# EAGLE schematic collatz_box (EAGLE 6.2)
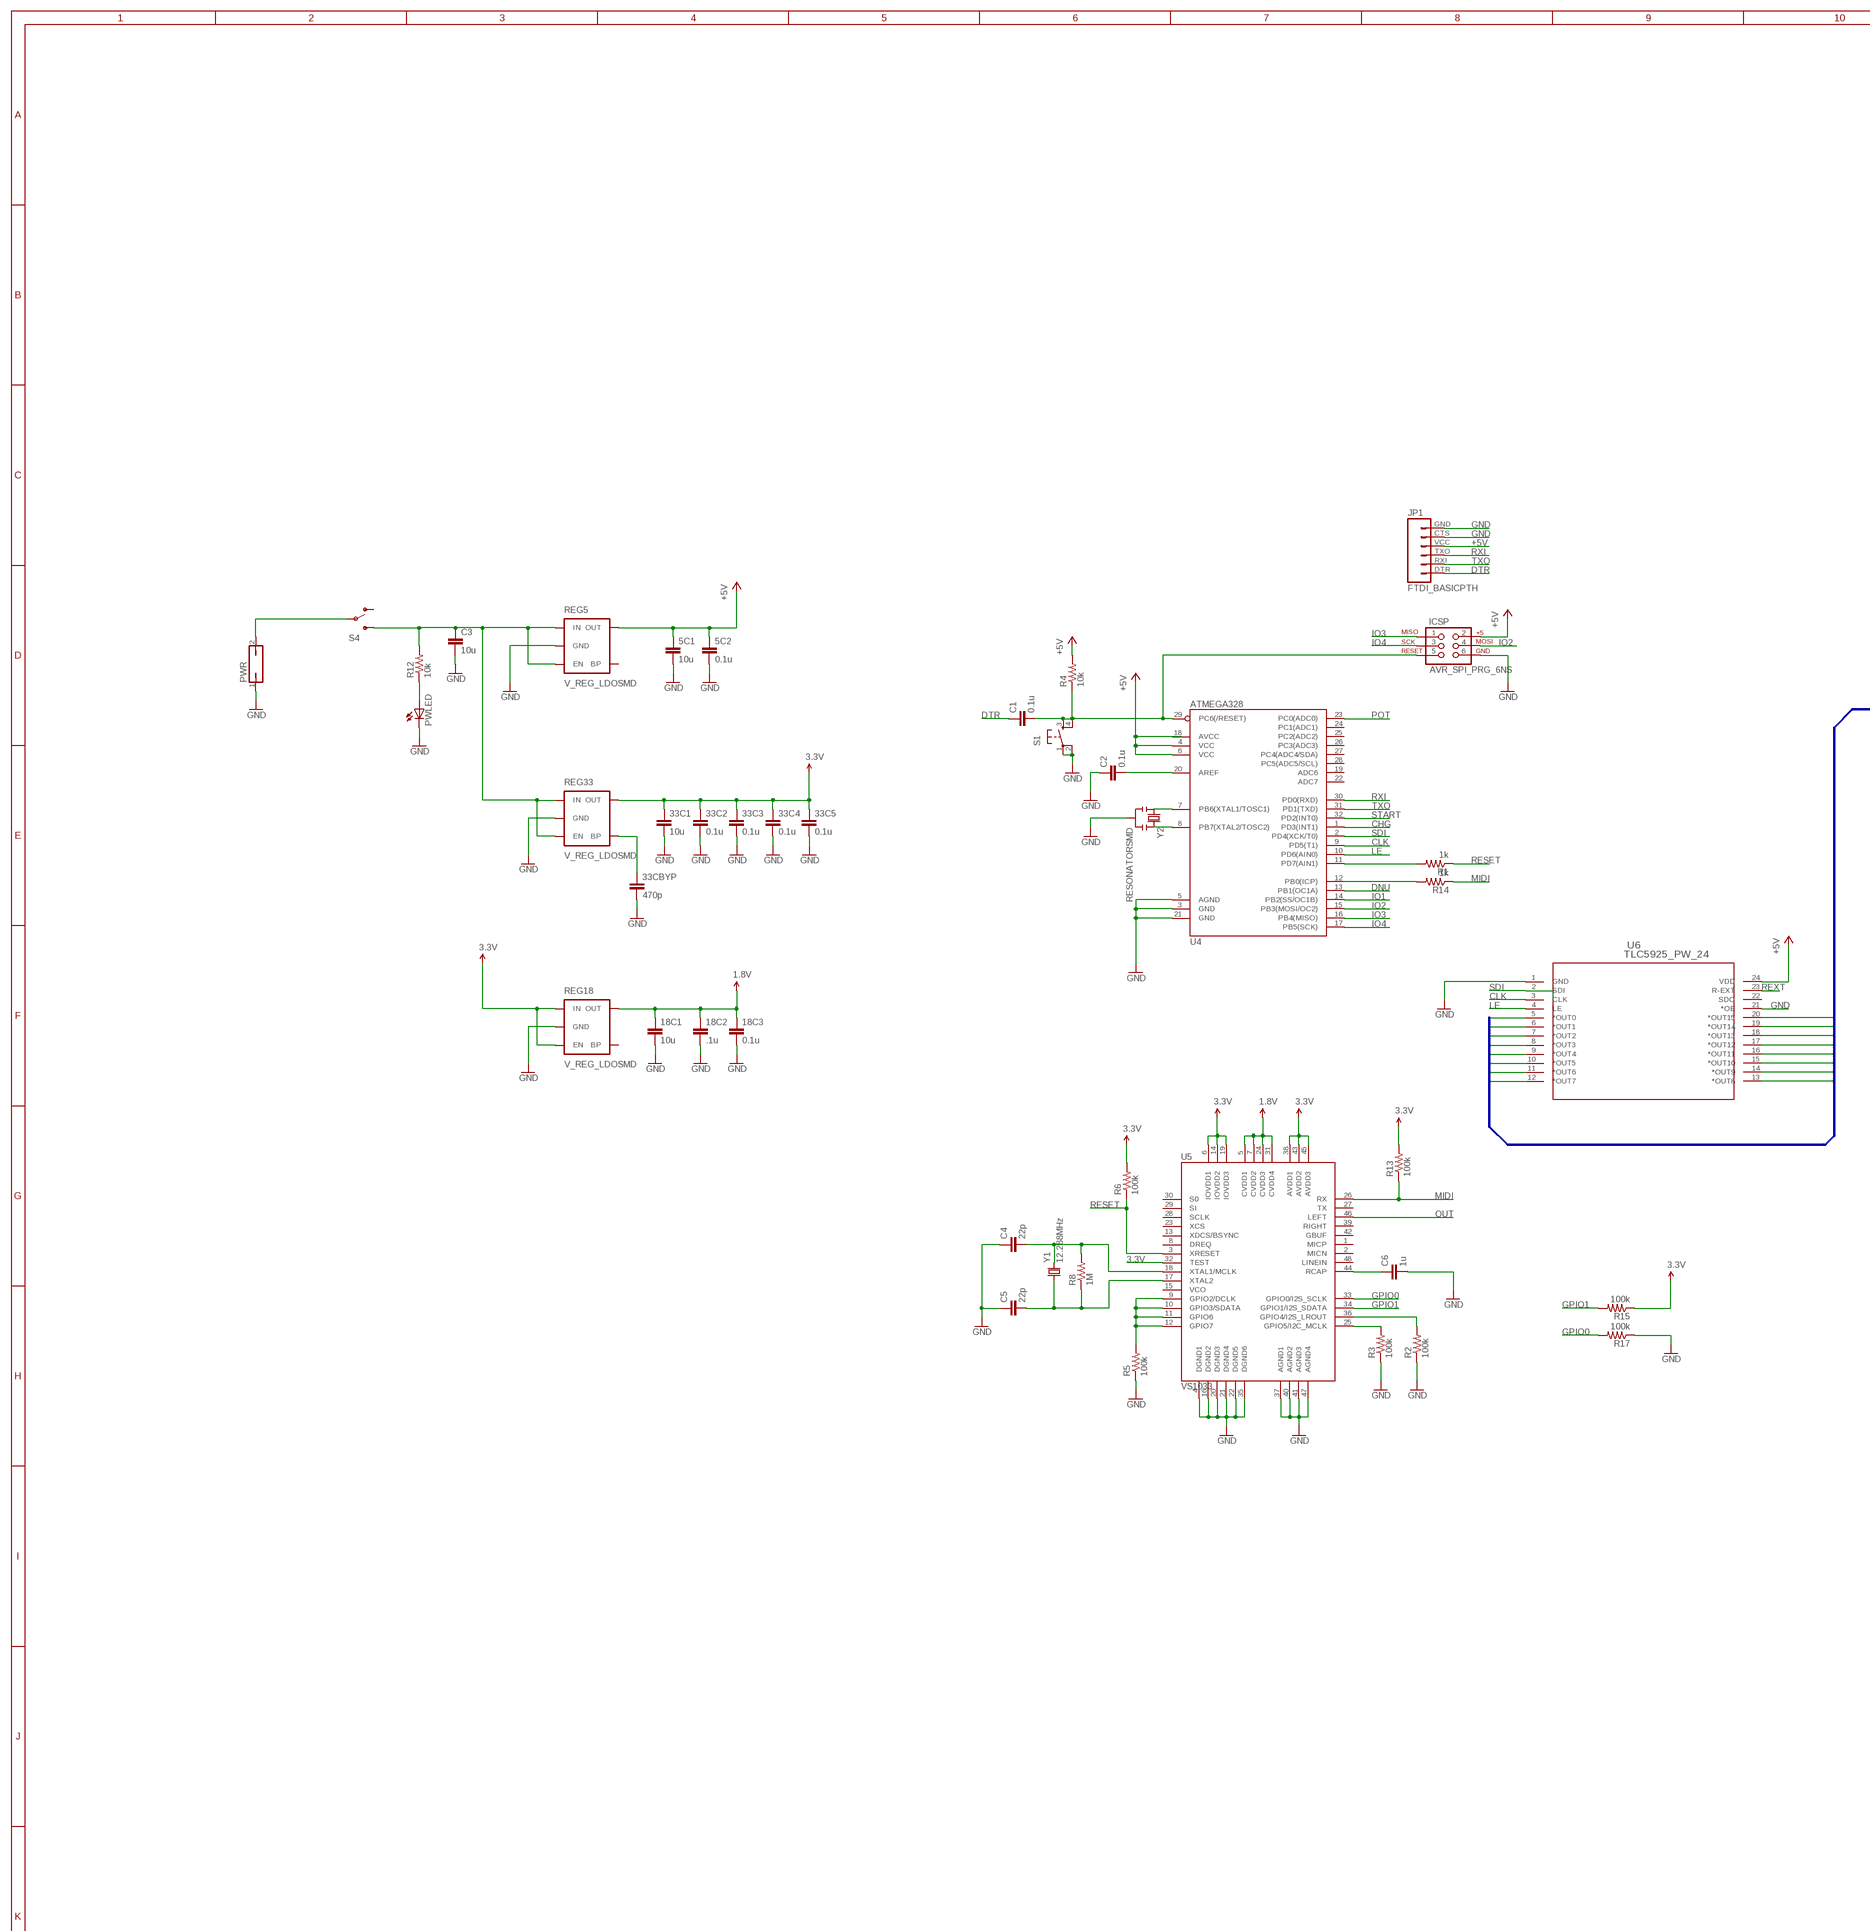
[diagram p0: schematic, sheet 1, part 1 of 3]
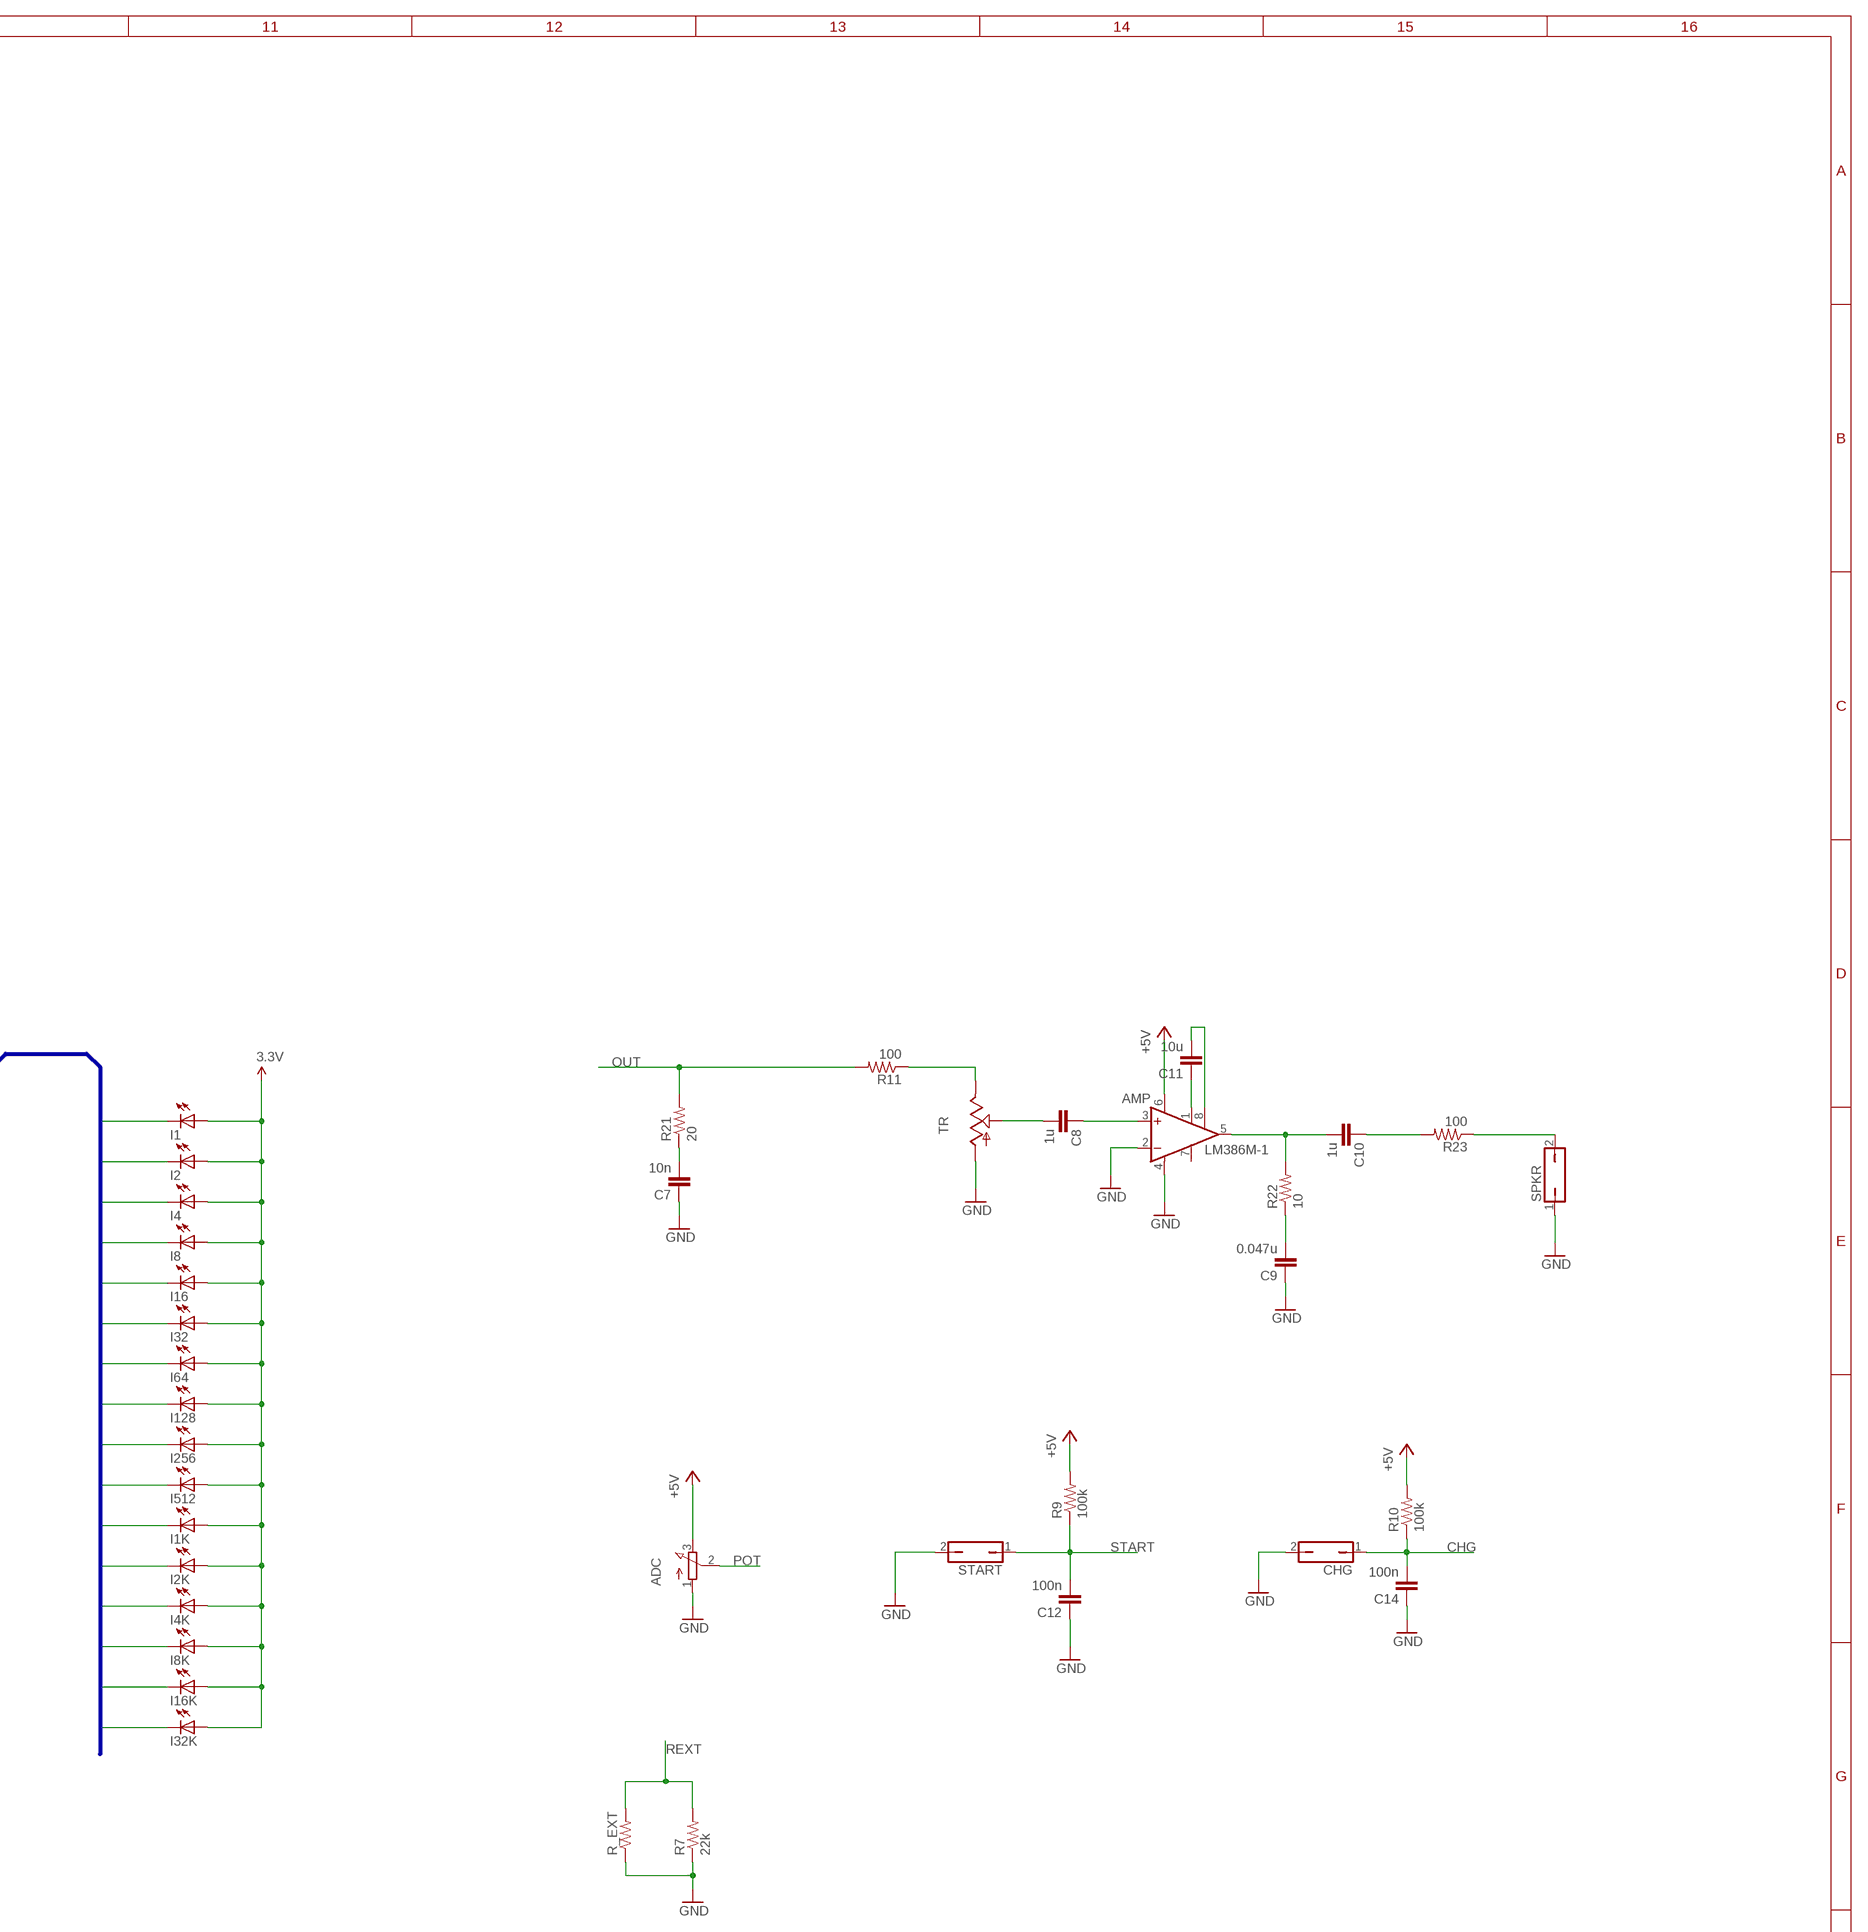
[diagram p1: schematic, sheet 1, part 2 of 3]
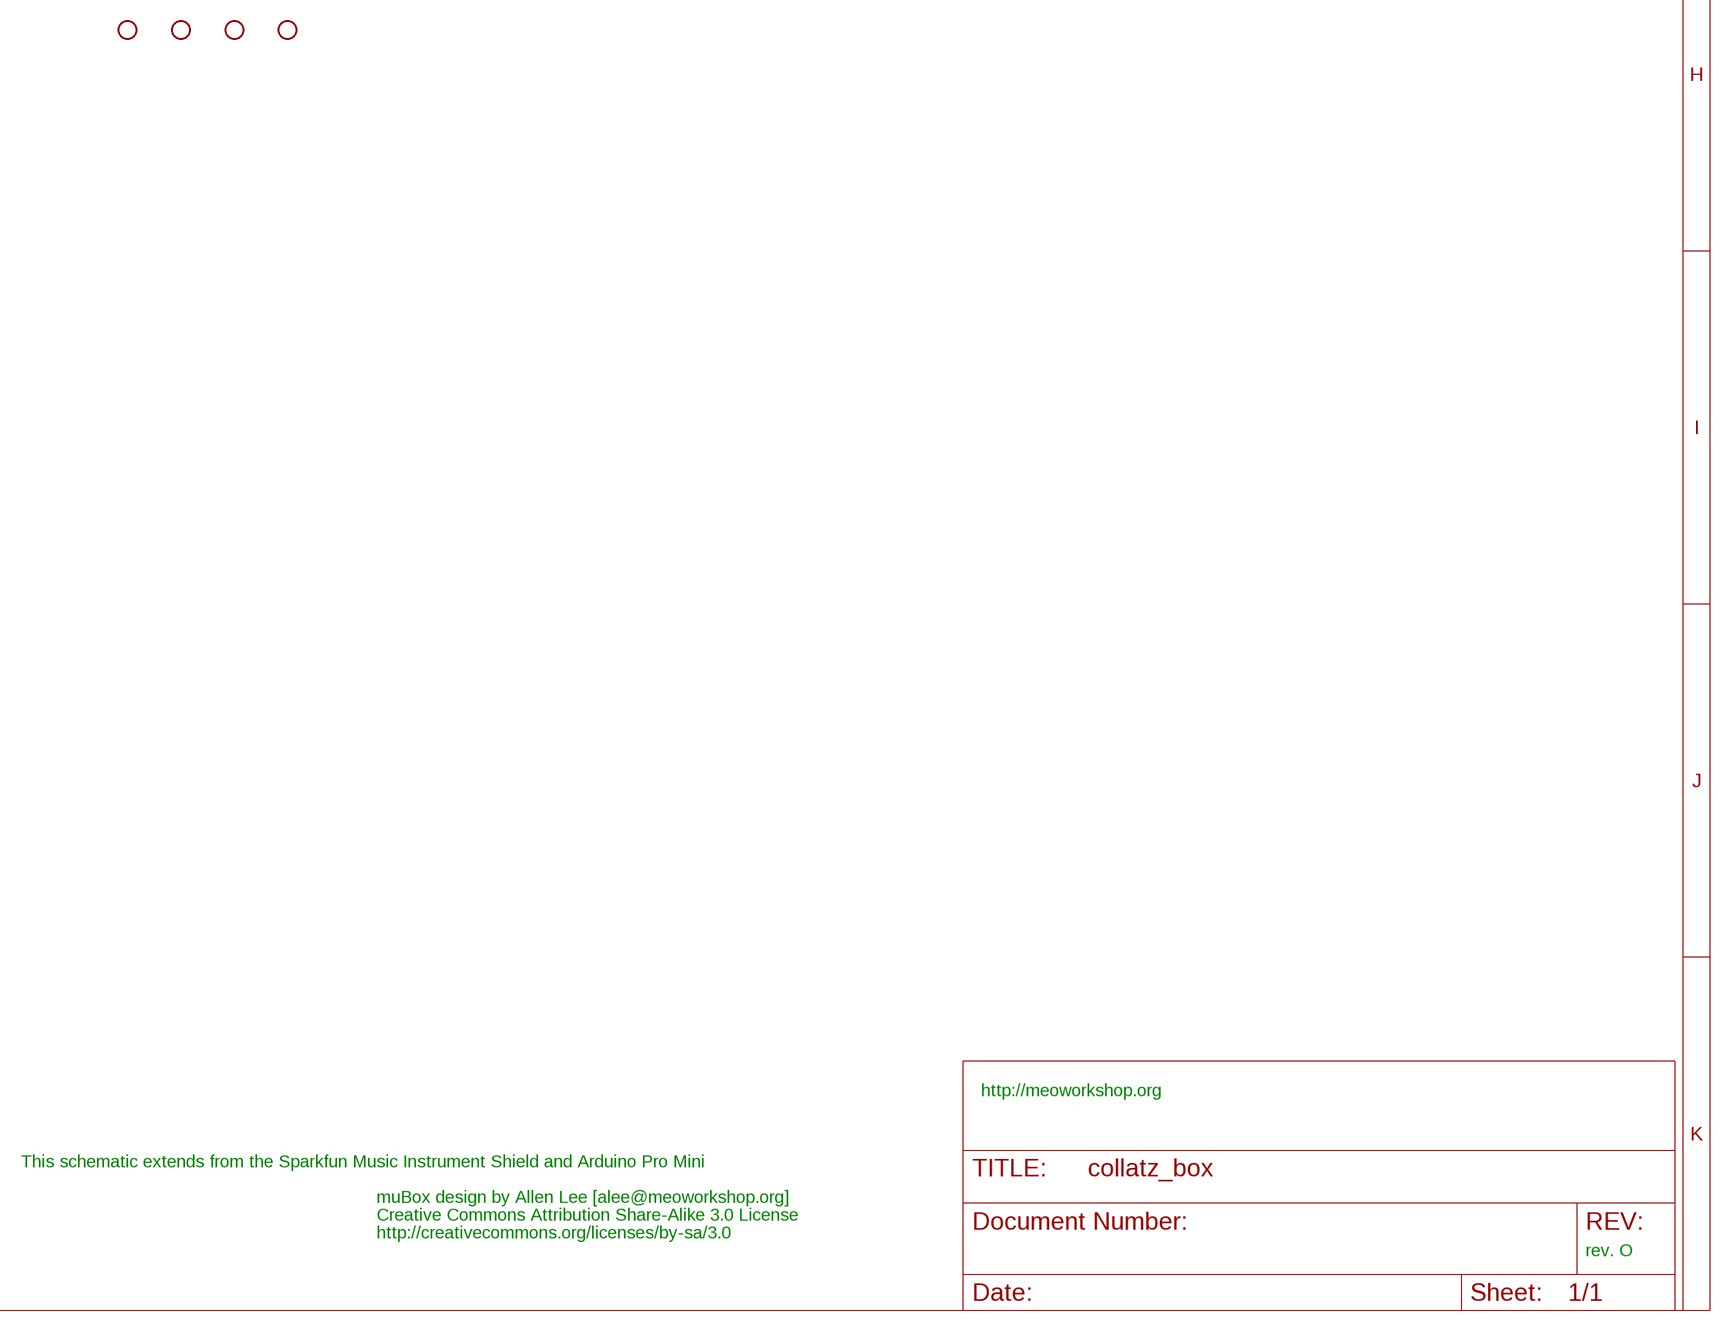
[diagram p2: schematic, sheet 1, part 3 of 3]

## Parts
5C1  10u  CAP1206  [1206]
5C2  0.1u  CAP0805  [0805]
18C1  10u  CAP1206  [1206]
18C2  .1u  CAP0805  [0805]
18C3  0.1u  CAP0805  [0805]
33C1  10u  CAP1206  [1206]
33C2  0.1u  CAP0805  [0805]
33C3  0.1u  CAP0805  [0805]
33C4  0.1u  CAP0805  [0805]
33C5  0.1u  CAP0805  [0805]
33CBYP  470p  CAP0805  [0805]
ADC  3RP/1610N  [3RP/1610N]
AMP  LM386M-1  [SO08]
C1  0.1u  CAP0805  [0805]
C2  0.1u  CAP0805  [0805]
C3  10u  CAP1206  [1206]
C4  22p  CAP0805  [0805]
C5  22p  CAP0805  [0805]
C6  1u  CAP0805  [0805]
C7  10n  CAP0805  [0805]
C8  1u  CAP0805  [0805]
C9  0.047u  CAP0805  [0805]
C10  1u  CAP0805  [0805]
C11  10u  CAP0805  [0805]
C12  100n  CAP0805  [0805]
C14  100n  CAP0805  [0805]
CHG  JP1Q  [JP1]
I1  LEDCHIPLED_1206  [CHIPLED_1206]
I1K  LEDCHIPLED_1206  [CHIPLED_1206]
I2  LEDCHIPLED_1206  [CHIPLED_1206]
I2K  LEDCHIPLED_1206  [CHIPLED_1206]
I4  LEDCHIPLED_1206  [CHIPLED_1206]
I4K  LEDCHIPLED_1206  [CHIPLED_1206]
I8  LEDCHIPLED_1206  [CHIPLED_1206]
I8K  LEDCHIPLED_1206  [CHIPLED_1206]
I16  LEDCHIPLED_1206  [CHIPLED_1206]
I16K  LEDCHIPLED_1206  [CHIPLED_1206]
I32  LEDCHIPLED_1206  [CHIPLED_1206]
I32K  LEDCHIPLED_1206  [CHIPLED_1206]
I64  LEDCHIPLED_1206  [CHIPLED_1206]
I128  LEDCHIPLED_1206  [CHIPLED_1206]
I256  LEDCHIPLED_1206  [CHIPLED_1206]
I512  LEDCHIPLED_1206  [CHIPLED_1206]
ICSP  AVR_SPI_PRG_6NS  [2X3-NS]
JP1  FTDI_BASICPTH  [FTDI_BASIC]
JP2  STAND-OFF  [STAND-OFF]
JP3  STAND-OFF  [STAND-OFF]
JP4  STAND-OFF  [STAND-OFF]
JP5  STAND-OFF  [STAND-OFF]
PWLED  LEDCHIPLED_1206  [CHIPLED_1206]
PWR  JP1Q  [JP1]
R1  1k  RESISTOR0805-RES  [0805]
R2  100k  RESISTOR0805-RES  [0805]
R3  100k  RESISTOR0805-RES  [0805]
R4  10k  RESISTOR0805-RES  [0805]
R5  100k  RESISTOR0805-RES  [0805]
R6  100k  RESISTOR0805-RES  [0805]
R7  22k  RESISTOR0805-RES  [0805]
R8  1M  RESISTOR0805-RES  [0805]
R9  100k  RESISTOR0805-RES  [0805]
R10  100k  RESISTOR0805-RES  [0805]
R11  100  RESISTOR0805-RES  [0805]
R12  10k  RESISTOR0805-RES  [0805]
R13  100k  RESISTOR0805-RES  [0805]
R14  1k  RESISTOR0805-RES  [0805]
R15  100k  RESISTOR0805-RES  [0805]
R17  100k  RESISTOR0805-RES  [0805]
R21  20  RESISTOR0805-RES  [0805]
R22  10  RESISTOR0805-RES  [0805]
R23  100  RESISTOR0805-RES  [0805]
R_EXT  RESISTORPTH-1/4W  [AXIAL-0.4]
REG5  V_REG_LDOSMD  [SOT23-5]
REG18  V_REG_LDOSMD  [SOT23-5]
REG33  V_REG_LDOSMD  [SOT23-5]
S1  TAC_SWITCHSMD  [TACTILE_SWITCH_SMD]
S4  SWITCH-SPDTPTH  [SWITCH-SPDT]
SPKR  JP1Q  [JP1]
START  JP1Q  [JP1]
TR  TRIM_US-3223W  [3223W]
U4  ATMEGA328  ATMEGA168  [TQFP32-08]
U5  VS1033  [LQFP-48]
U6  TLC5925_PW_24  [PW24]
Y1  12.288MHz  CRYSTAL5X3  [CRYSTAL-SMD-5X3]
Y2  RESONATORSMD  [RESONATOR-SMD]

## Nets
1.8V: 18C1.1 18C2.1 18C3.1 REG18.5(OUT) U5.5(CVDD1) U5.7(CVDD2) U5.24(CVDD3) U5.31(CVDD4)
3.3V: 33C1.1 33C2.1 33C3.1 33C4.1 33C5.1 I1.A I1K.A I2.A I2K.A I4.A I4K.A I8.A I8K.A I16.A I16K.A I32.A I32K.A I64.A I128.A I256.A I512.A R6.2 R13.2 R15.1 REG18.1(IN) REG18.3(EN) REG33.5(OUT) U5.6(IOVDD1) U5.14(IOVDD2) U5.19(IOVDD3) U5.32(TEST) U5.38(AVDD1) U5.43(AVDD2) U5.45(AVDD3)
+5V: 5C1.1 5C2.1 ADC.3(E) AMP.6(VS) ICSP.2 JP1.VCC R4.2 R9.2 R10.2 REG5.5(OUT) U4.4(VCC) U4.6(VCC) U6.24(VDD)
CHG: C14.2 CHG.1 R10.1 U4.1(PD3(INT1))
CLK: U4.9(PD5(T1)) U6.3(CLK)
DNU: U4.13(PB1(OC1A))
DTR: C1.1 C1.2 ICSP.5 JP1.DTR R4.1 S1.3 S1.4 U4.29(PC6(/RESET))
GND: 5C1.2 5C2.2 18C1.2 18C2.2 18C3.2 33C1.2 33C2.2 33C3.2 33C4.2 33C5.2 33CBYP.2 ADC.1(A) AMP.2(-IN) AMP.4(GND) C2.1 C3.2 C4.1 C5.1 C6.2 C7.1 C9.1 C12.1 C14.1 CHG.2 ICSP.6 JP1.CTS JP1.GND PWLED.C PWR.1 R2.1 R3.1 R5.1 R7.1 R17.1 R_EXT.P$1 REG5.2(GND) REG18.2(GND) REG33.2(GND) S1.1 S1.2 SPKR.1 START.2 TR.1(A) U4.3(GND) U4.5(AGND) U4.21(GND) U5.4(DGND1) U5.16(DGND2) U5.20(DGND3) U5.21(DGND4) U5.22(DGND5) U5.35(DGND6) U5.37(AGND1) U5.40(AGND2) U5.41(AGND3) U5.47(AGND4) U6.1(GND) U6.21(*OE) Y2.2
GPIO0: R17.2 U5.33(GPIO0/I2S_SCLK)
GPIO1: R15.2 U5.34(GPIO1/I2S_SDATA)
IO1: U4.14(PB2(SS/OC1B))
IO2: ICSP.4 U4.15(PB3(MOSI/OC2))
IO3: ICSP.1 U4.16(PB4(MISO))
IO4: ICSP.3 U4.17(PB5(SCK))
LE: U4.10(PD6(AIN0)) U6.4(LE)
MIDI: R13.1 R14.1 U5.26(RX)
N$1: PWLED.A R12.1
N$2: 33CBYP.1 REG33.4(BP)
N$4: C4.2 R8.2 U5.18(XTAL1/MCLK) Y1.3
N$5: C5.2 R8.1 U5.17(XTAL2) Y1.1
N$6: U4.7(PB6(XTAL1/TOSC1)) Y2.1
N$7: R3.2 U5.25(GPIO5/I2C_MCLK)
N$8: R2.2 U5.36(GPIO4/I2S_LROUT)
N$9: U4.8(PB7(XTAL2/TOSC2)) Y2.3
N$10: C6.1 U5.44(RCAP)
N$11: C2.2 U4.20(AREF)
N$12: C10.1 R23.2
N$13: C7.2 R21.1
N$15: R11.1 TR.3(E)
N$17: C8.2 TR.2(S)
N$18: AMP.3(+IN) C8.1
N$19: R23.1 SPKR.2
N$25: AMP.1(GAIN) C11.1
N$26: AMP.8(GAIN) C11.2
N$27: R5.2 U5.9(GPIO2/DCLK) U5.10(GPIO3/SDATA) U5.11(GPIO6) U5.12(GPIO7)
N$29: AMP.5(OUT) C10.2 R22.2
N$30: C9.2 R22.1
N$42: PWR.2 S4.2(P)
N$51: R1.2 U4.11(PD7(AIN1))
N$52: R14.2 U4.12(PB0(ICP))
OUT: R11.2 R21.2 U5.46(LEFT)
OUT0: I1.C U6.5(*OUT0)
OUT1: I2.C U6.6(*OUT1)
OUT2: I4.C U6.7(*OUT2)
OUT3: I8.C U6.8(*OUT3)
OUT4: I16.C U6.9(*OUT4)
OUT5: I32.C U6.10(*OUT5)
OUT6: I64.C U6.11(*OUT6)
OUT7: I128.C U6.12(*OUT7)
OUT8: I256.C U6.13(*OUT8)
OUT9: I512.C U6.14(*OUT9)
OUT10: I1K.C U6.15(*OUT10)
OUT11: I2K.C U6.16(*OUT11)
OUT12: I4K.C U6.17(*OUT12)
OUT13: I8K.C U6.18(*OUT13)
OUT14: I16K.C U6.19(*OUT14)
OUT15: I32K.C U6.20(*OUT15)
POT: ADC.2(S) U4.23(PC0(ADC0))
PWIN: C3.1 R12.2 REG5.1(IN) REG5.3(EN) REG33.1(IN) REG33.3(EN) S4.3(S)
RESET: R1.1 R6.1 U5.3(XRESET)
REXT: R7.2 R_EXT.P$2 U6.23(R-EXT)
RXI: JP1.TXO U4.30(PD0(RXD))
SDI: U4.2(PD4(XCK/T0)) U6.2(SDI)
START: C12.2 R9.1 START.1 U4.32(PD2(INT0))
TXO: JP1.RXI U4.31(PD1(TXD))
Unconnected: AMP.7(BYPASS) REG5.4(BP) REG18.4(BP) S4.1(O) U4.18(AVCC) U4.19(ADC6) U4.22(ADC7) U4.24(PC1(ADC1)) U4.25(PC2(ADC2)) U4.26(PC3(ADC3)) U4.27(PC4(ADC4/SDA)) U4.28(PC5(ADC5/SCL)) U5.1(MICP) U5.2(MICN) U5.8(DREQ) U5.13(XDCS/BSYNC) U5.15(VCO) U5.23(XCS) U5.27(TX) U5.28(SCLK) U5.29(SI) U5.30(S0) U5.39(RIGHT) U5.42(GBUF) U5.48(LINEIN) U6.22(SDO)

## Buses
OUT[0..15]

## Notes on the sheet
- http://meoworkshop.org
- This schematic extends from the Sparkfun Music Instrument Shield and Arduino Pro Mini
- muBox design by Allen Lee [alee@meoworkshop.org]
- Creative Commons Attribution Share-Alike 3.0 License
- http://creativecommons.org/licenses/by-sa/3.0
- rev. O

## Library data of the parts
5C1 18C1 33C1 C3 = SparkFun-Passives:CAP: Capacitor Standard 0603 ceramic capacitor, and 0.1" leaded capacitor.
5C2 18C2 18C3 33C2-33C5 33CBYP C1 C2 C4-C12 C14 = SparkFun-Capacitors:CAP: Capacitor Standard 0603 ceramic capacitor, and 0.1" leaded capacitor.
ADC = pot:3RP/1610N: 16mm Potentiometer one level Source: http://www.alphapotentiometers.net/html/16mm_pot_2.html
AMP = linear:LM386?-*: Low Voltage Audio Power Amplifier Source: http://cache.national.com/ds/LM/LM386.pdf
CHG PWR SPKR START = jumper:JP1Q: JUMPER
I1 I1K I2 I2K I4 I4K I8 I8K I16 I16K I32 I32K I64 I128 I256 I512 PWLED = led:LED: LED OSRAM: - CHIPLED LG R971, LG N971, LY N971, LG Q971, LY Q971, LO R971, LY R971 LH N974, LH R974 LS Q976, LO Q976, LY Q976 LO Q996 - Hyper CHIPLED LW Q18S LB Q993, LB Q99A, LB R99A - SideLED LS A670, LO A670, LY A670, LG A670, LP A670 LB A673, LV A673, LT A673, LW A673 LH A674 LY A675 LS A676, LA A676, LO A676, LY A676, LW A676 LS A679, LY A679, LG A679 - Hyper Micro SIDELED® LS Y876, LA Y876, LO Y876, LY Y876 LT Y87S - SmartLED LW L88C, LW L88S LB L89C, LB L89S, LG L890 LS L89K, LO L89K, LY L89K LS L896, LA L896, LO L896, LY L896 - TOPLED LS T670, LO T670, LY T670, LG T670, LP T670 LSG T670, LSP T670, LSY T670, LOP T670, LYG T670 LG T671, LOG T671, LSG T671 LB T673, LV T673, LT T673, LW T673 LH T674 LS T676, LA T676, LO T676, LY T676, LB T676, LH T676, LSB T676, LW T676 LB T67C, LV T67C, LT T67C, LS T67K, LO T67K, LY T67K, LW E67C LS E67B, LA E67B, LO E67B, LY E67B, LB E67C, LV E67C, LT E67C LW T67C LS T679, LY T679, LG T679 LS T770, LO T770, LY T770, LG T770, LP T770 LB T773, LV T773, LT T773, LW T773 LH T774 LS E675, LA E675, LY E675, LS T675 LS T776, LA T776, LO T776, LY T776, LB T776 LHGB T686 LT T68C, LB T68C - Hyper Mini TOPLED® LB M676 - Mini TOPLED Santana® LG M470 LS M47K, LO M47K, LY M47K Source: http://www.osram.convergy.de LUXEON: - LUMILED® LXK2-PW12-R00, LXK2-PW12-S00, LXK2-PW14-U00, LXK2-PW14-V00 LXK2-PM12-R00, LXK2-PM12-S00, LXK2-PM14-U00 LXK2-PE12-Q00, LXK2-PE12-R00, LXK2-PE12-S00, LXK2-PE14-T00, LXK2-PE14-U00 LXK2-PB12-K00, LXK2-PB12-L00, LXK2-PB12-M00, LXK2-PB14-N00, LXK2-PB14-P00, LXK2-PB14-Q00 LXK2-PR12-L00, LXK2-PR12-M00, LXK2-PR14-Q00, LXK2-PR14-R00 LXK2-PD12-Q00, LXK2-PD12-R00, LXK2-PD12-S00 LXK2-PH12-R00, LXK2-PH12-S00 LXK2-PL12-P00, LXK2-PL12-Q00, LXK2-PL12-R00 Source: www.luxeon.com KINGBRIGHT: KA-3528ASYC Source: www.kingbright.com
ICSP = SparkFun-Connectors:AVR_SPI_PRG_6: AVR ISP 6 Pin This is the reduced ISP connector for AVR programming. Common on Arduino. This footprint will take up less PCB space and can be used with a 10-pin to 6-pin adapter such as SKU: BOB-08508
JP1 = SparkFun-Connectors:FTDI_BASIC: FTDI Basic header with labels
JP2-JP5 = SparkFun-Electromechanical:STAND-OFF: #4 Stand Off This is the mechanical footprint for a #4 phillips button head screw. Use the keepout ring to avoid running the screw head into surrounding components. SKU : PRT-00447
R1-R15 R17 R21-R23 = SparkFun-Passives:RESISTOR: Resistor Basic schematic elements and footprints for 0603, 1206, and PTH resistors.
R_EXT = SparkFun-Resistors:RESISTOR: Resistor Basic schematic elements and footprints for 0603, 1206, and PTH resistors.
REG5 REG18 REG33 = SparkFun-PowerIC:V_REG_LDO: Voltage Regulator LDO Standard 150mA LDO voltage regulator in SOT-23 layout. Micrel part MIC5205. BP (by-pass) pin is used to lower output noise with 470pF cap.
S1 = SparkFun-Electromechanical:TAC_SWITCH: Momentary Switch Button commonly used for reset or general input. Spark Fun Electronics SKU : COM-00097
S4 = SparkFun-Electromechanical:SWITCH-SPDT: SPST Switch Simple slide switch. Spark Fun Electronics SKU : COM-00102
TR = pot:TRIM_US-: POTENTIOMETER
U4 = SparkFun-DigitalIC:ATMEGA168: Atmel 32-pin 8-bit micro, 16k flash.
U5 = SparkFun-DigitalIC:VS1033: MP3 codec
U6 = ti_tlc_5925:TLC5925_PW_24; DATASHEETURL: http://www.ti.com/lit/gpn/TLC5925; DESCRIPTION: Low-Power 16-Channel Constant-Current LED Sink Driver; FAMILY_NAME: LED DRIVER; GENERIC_PART_NUMBER: TLC5925; INDUSTRY_STD_PKG_TYPE: TSSOP; MANUFACTURER: Texas Instruments; MANUFACTURER_PART_NUMBER: tlc5925_pw_24; PACKAGE_DESIGNATOR: PW; PIN_COUNT: 24; VENDOR: Texas Instruments
Y1 = SparkFun-FreqCtrl:CRYSTAL: Various standard crystals. Proven footprints. Spark Fun Electronics SKU : COM-00534
Y2 = SparkFun-FreqCtrl:RESONATOR: Resonator Small SMD resonator. This is the itty bitty 10/20MHz resonators with built in caps. CSTCE10M0G55 and CSTCE20M0V53. Footprint has been reviewed closely but hasn't been tested yet.